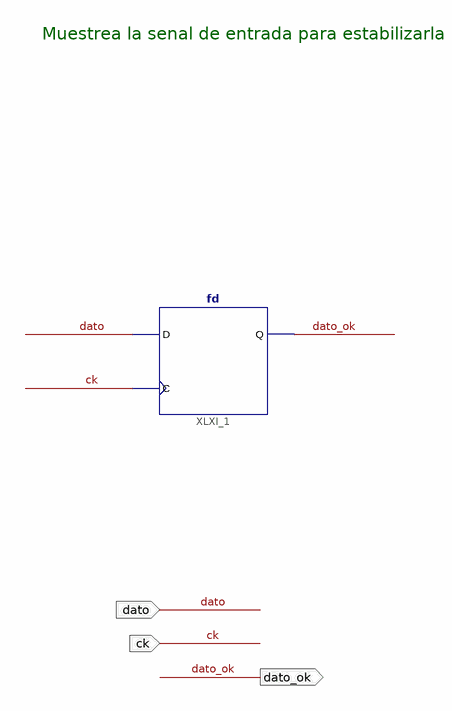
[diagram p0: schematic sheet 1]
// Xilinx ISE schematic detector.sch (spartan3e) as structural Verilog: 1 symbols, 3 ports
module detector (
  input  dato,
  input  ck,
  output dato_ok
);

  fd XLXI_1 (.C(ck), .D(dato), .Q(dato_ok));

  // Notes on the sheet:
  //   Muestrea la senal de entrada para estabilizarla
endmodule
